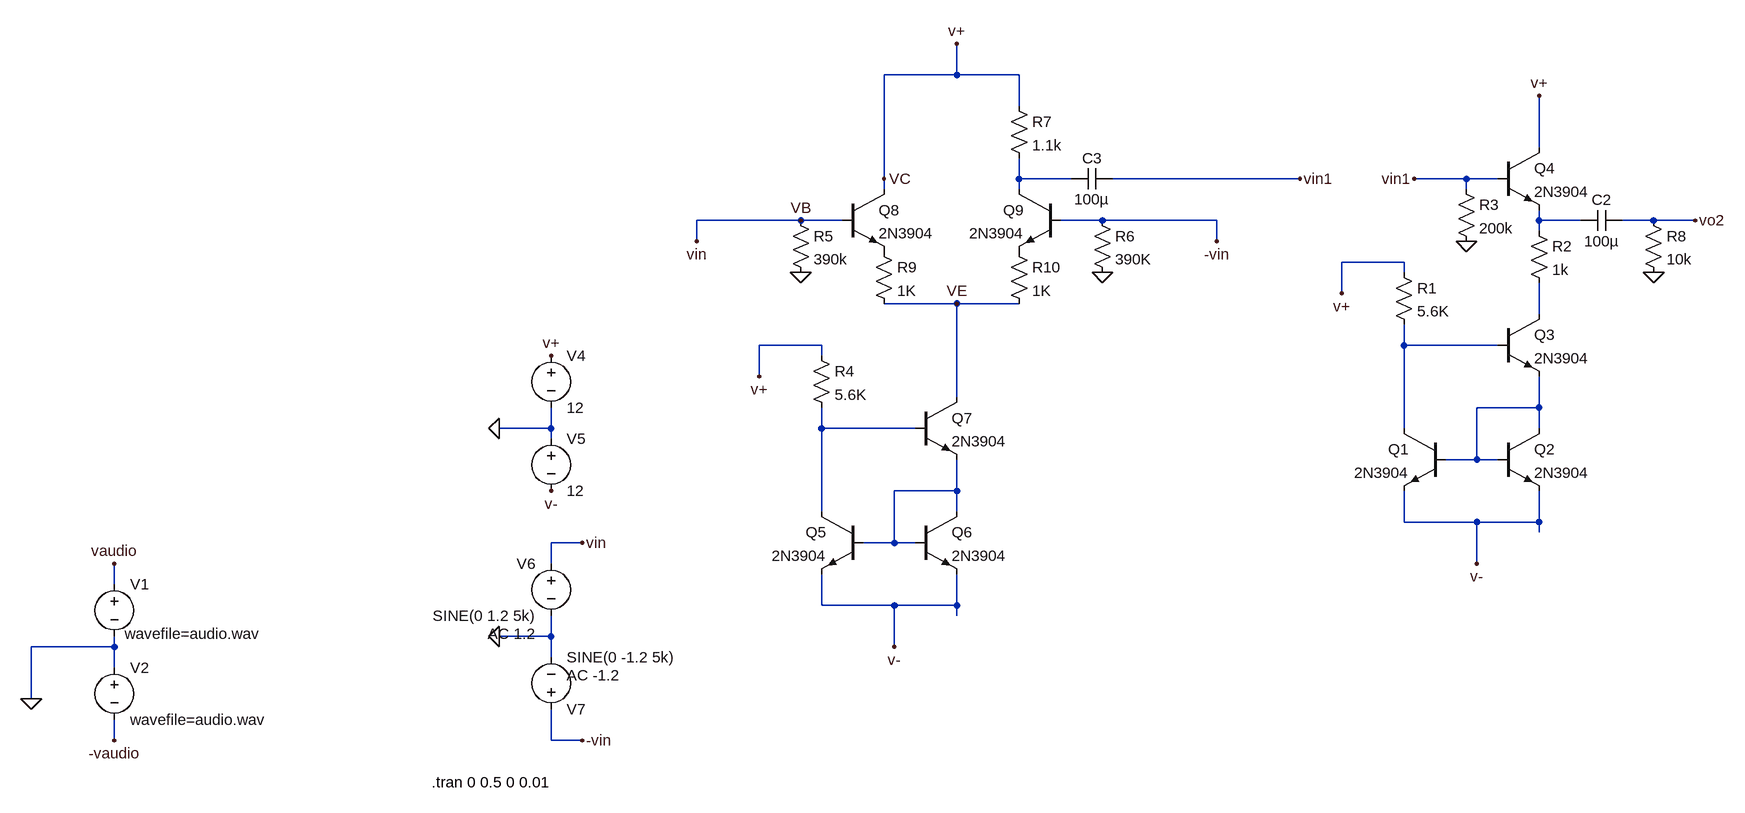
[diagram p0: schematic amp_filtrado_audio.asc]
amp_filtrado_audio.asc, the LTspice schematic file:
Version 4
SHEET 1 880 836
WIRE -752 -320 -752 -368
WIRE -752 -320 -864 -320
WIRE -656 -320 -752 -320
WIRE -656 -272 -656 -320
WIRE 144 -208 144 -288
WIRE -864 -160 -864 -320
WIRE -656 -160 -656 -192
WIRE -576 -160 -656 -160
WIRE -224 -160 -512 -160
WIRE 32 -160 -48 -160
WIRE 80 -160 32 -160
WIRE -864 -144 -864 -160
WIRE -656 -144 -656 -160
WIRE 32 -144 32 -160
WIRE -992 -96 -1152 -96
WIRE -928 -96 -992 -96
WIRE -528 -96 -592 -96
WIRE -352 -96 -528 -96
WIRE 144 -96 144 -112
WIRE 208 -96 144 -96
WIRE 320 -96 272 -96
WIRE 384 -96 320 -96
WIRE 144 -80 144 -96
WIRE -1152 -64 -1152 -96
WIRE -352 -64 -352 -96
WIRE -64 -32 -160 -32
WIRE -64 -16 -64 -32
WIRE -160 16 -160 -32
WIRE -752 32 -864 32
WIRE -656 32 -752 32
WIRE 144 48 144 0
WIRE -960 96 -1056 96
WIRE -64 96 -64 64
WIRE 80 96 -64 96
WIRE -960 112 -960 96
WIRE -1056 144 -1056 96
WIRE -752 176 -752 32
WIRE 144 192 144 144
WIRE 144 192 48 192
WIRE -1376 224 -1376 192
WIRE -1376 224 -1456 224
WIRE -960 224 -960 192
WIRE -816 224 -960 224
WIRE -64 224 -64 96
WIRE 144 224 144 192
WIRE -1376 240 -1376 224
WIRE 48 272 48 192
WIRE 48 272 0 272
WIRE 80 272 48 272
WIRE -752 320 -752 272
WIRE -752 320 -848 320
WIRE -960 352 -960 224
WIRE -752 352 -752 320
WIRE -64 368 -64 320
WIRE 48 368 -64 368
WIRE 144 368 144 320
WIRE 144 368 48 368
WIRE 144 384 144 368
WIRE -1328 400 -1376 400
WIRE -848 400 -848 320
WIRE -848 400 -896 400
WIRE -816 400 -848 400
WIRE -1376 432 -1376 400
WIRE 48 432 48 368
WIRE -2048 464 -2048 432
WIRE -960 496 -960 448
WIRE -848 496 -960 496
WIRE -752 496 -752 448
WIRE -752 496 -848 496
WIRE -752 512 -752 496
WIRE -1376 544 -1376 512
WIRE -1376 544 -1456 544
WIRE -2048 560 -2048 544
WIRE -2048 560 -2176 560
WIRE -848 560 -848 496
WIRE -1376 576 -1376 544
WIRE -2048 592 -2048 560
WIRE -2176 640 -2176 560
WIRE -2048 704 -2048 672
WIRE -1376 704 -1376 656
WIRE -1328 704 -1376 704
FLAG -160 16 v+
FLAG 48 432 v-
FLAG 144 -288 v+
FLAG 32 -64 0
FLAG -48 -160 vin1
FLAG 384 -96 vo2
FLAG -992 -96 VB
FLAG -752 32 VE
FLAG -864 -160 VC
FLAG -1376 320 v-
FLAG -1056 144 v+
FLAG -848 560 v-
FLAG -1376 112 v+
FLAG -992 -16 0
FLAG -528 -16 0
FLAG -752 -368 v+
FLAG -1456 224 0
FLAG -1328 400 vin
FLAG -1152 -64 vin
FLAG -352 -64 -vin
FLAG -1328 704 -vin
FLAG -1456 544 0
FLAG -224 -160 vin1
FLAG 320 -16 0
FLAG -2176 640 0
FLAG -2048 432 vaudio
FLAG -2048 704 -vaudio
SYMBOL npn 0 224 M0
SYMATTR InstName Q1
SYMATTR Value 2N3904
SYMBOL npn 80 224 R0
SYMATTR InstName Q2
SYMATTR Value 2N3904
SYMBOL npn 80 48 R0
SYMATTR InstName Q3
SYMATTR Value 2N3904
SYMBOL res -80 -32 R0
SYMATTR InstName R1
SYMATTR Value 5.6K
SYMBOL npn 80 -208 R0
SYMATTR InstName Q4
SYMATTR Value 2N3904
SYMBOL res 128 -96 R0
SYMATTR InstName R2
SYMATTR Value 1k
SYMBOL res 16 -160 R0
SYMATTR InstName R3
SYMATTR Value 200k
SYMBOL cap 272 -112 R90
WINDOW 0 0 32 VBottom 2
WINDOW 3 32 32 VTop 2
SYMATTR InstName C2
SYMATTR Value 100µ
SYMBOL npn -896 352 M0
SYMATTR InstName Q5
SYMATTR Value 2N3904
SYMBOL npn -816 352 R0
SYMATTR InstName Q6
SYMATTR Value 2N3904
SYMBOL npn -816 176 R0
SYMATTR InstName Q7
SYMATTR Value 2N3904
SYMBOL res -976 96 R0
SYMATTR InstName R4
SYMATTR Value 5.6K
SYMBOL npn -928 -144 R0
SYMATTR InstName Q8
SYMATTR Value 2N3904
SYMBOL npn -592 -144 M0
SYMATTR InstName Q9
SYMATTR Value 2N3904
SYMBOL res -1008 -112 R0
SYMATTR InstName R5
SYMATTR Value 390k
SYMBOL res -544 -112 R0
SYMATTR InstName R6
SYMATTR Value 390K
SYMBOL res -672 -288 R0
SYMATTR InstName R7
SYMATTR Value 1.1k
SYMBOL cap -512 -176 R90
WINDOW 0 0 32 VBottom 2
WINDOW 3 32 32 VTop 2
SYMATTR InstName C3
SYMATTR Value 100µ
SYMBOL voltage -1376 96 R0
WINDOW 123 0 0 Left 2
WINDOW 39 0 0 Left 2
SYMATTR InstName V4
SYMATTR Value 12
SYMBOL voltage -1376 224 R0
WINDOW 123 0 0 Left 2
WINDOW 39 0 0 Left 2
SYMATTR InstName V5
SYMATTR Value 12
SYMBOL res -880 -64 R0
SYMATTR InstName R9
SYMATTR Value 1K
SYMBOL res -672 -64 R0
SYMATTR InstName R10
SYMATTR Value 1K
SYMBOL voltage -1376 416 M0
WINDOW 123 24 124 Left 2
WINDOW 39 0 0 Left 2
SYMATTR Value2 AC 1.2
SYMATTR InstName V6
SYMATTR Value SINE(0 1.2 5k)
SYMBOL voltage -1376 672 M180
WINDOW 123 24 68 Left 2
WINDOW 39 0 0 Left 2
SYMATTR Value2 AC -1.2
SYMATTR InstName V7
SYMATTR Value SINE(0 -1.2 5k)
SYMBOL res 304 -112 R0
SYMATTR InstName R8
SYMATTR Value 10k
SYMBOL voltage -2048 448 R0
WINDOW 3 16 92 Left 2
SYMATTR Value wavefile=audio.wav
SYMATTR InstName V1
SYMBOL voltage -2048 576 R0
SYMATTR InstName V2
SYMATTR Value wavefile=audio.wav
TEXT -1560 768 Left 2 !.tran 0 0.5 0 0.01

The netlist it stands for:
* amp_filtrado_audio.asc
Q1 N004 N005 v- 0 2N3904
Q2 N005 N005 v- 0 2N3904
Q3 N003 N004 N005 0 2N3904
R1 VC N004 5.6K
Q4 VC vin1 N002 0 2N3904
R2 N002 N003 1k
R3 vin1 0 200k
C2 vo2 N002 100µ
Q5 N006 N007 v- 0 2N3904
Q6 N007 N007 v- 0 2N3904
Q7 VE N006 N007 0 2N3904
R4 VC N006 5.6K
Q8 VC vin P001 0 2N3904
Q9 N001 -vin P002 0 2N3904
R5 vin 0 390k
R6 -vin 0 390K
R7 VC N001 1.1k
C3 vin1 N001 100µ
V4 VC 0 12
V5 0 v- 12
R9 P001 VE 1K
R10 P002 VE 1K
V6 vin 0 SINE(0 1.2 5k) AC 1.2
V7 -vin 0 SINE(0 -1.2 5k) AC -1.2
R8 vo2 0 10k
V1 vaudio 0 wavefile=audio.wav
V2 0 -vaudio wavefile=audio.wav
.model NPN NPN
.model PNP PNP
.lib standard.bjt
.tran 0 0.5 0 0.01
.backanno
.end